# Altium schematic sheet 原理图.SchDoc
size A3
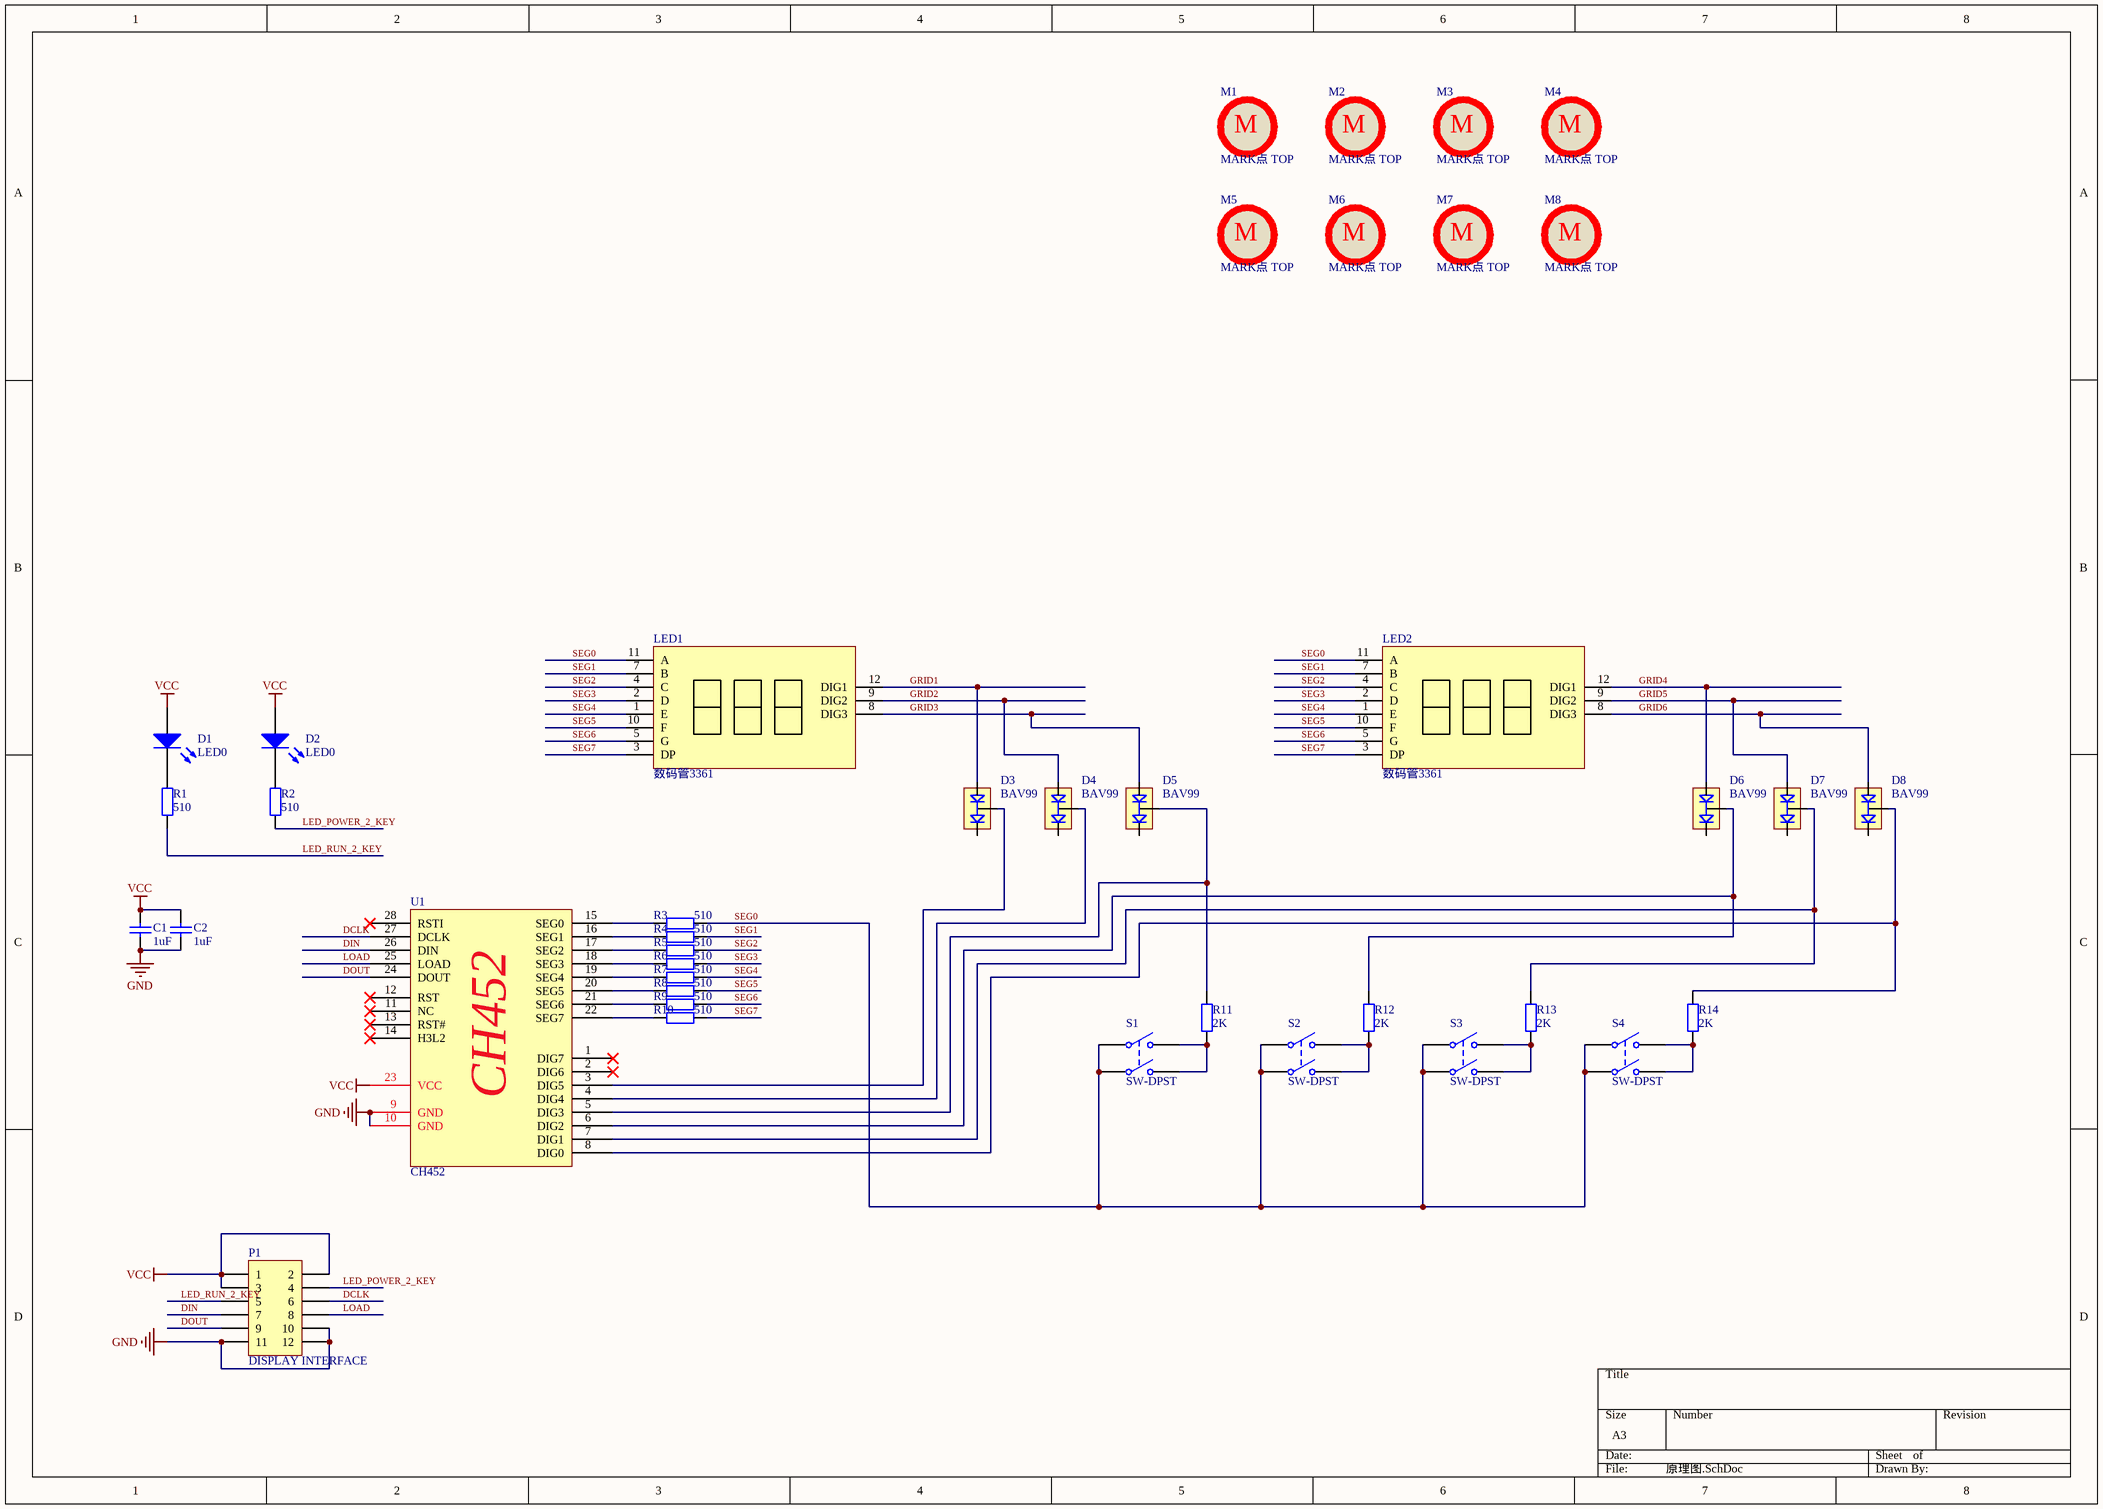
[diagram p0: 原理图.SchDoc]

## Parts
C1  1uF  [C SMD 0603]
C2  1uF  [C SMD 0603]
D1  LED0  [LED DIP 3mm]
D2  LED0  [LED DIP 3mm]
D3  BAV99  [SOT23]
D4  BAV99  [SOT23]
D5  BAV99  [SOT23]
D6  BAV99  [SOT23]
D7  BAV99  [SOT23]
D8  BAV99  [SOT23]
LED1  数码管3361  [数码管3361]
LED2  数码管3361  [数码管3361]
M1  MARK点 TOP  [MARK点 TOP]
M2  MARK点 TOP  [MARK点 TOP]
M3  MARK点 TOP  [MARK点 TOP]
M4  MARK点 TOP  [MARK点 TOP]
M5  MARK点 TOP  [MARK点 TOP]
M6  MARK点 TOP  [MARK点 TOP]
M7  MARK点 TOP  [MARK点 TOP]
M8  MARK点 TOP  [MARK点 TOP]
P1  DISPLAY INTERFACE  [FFC_1.0mm_12pin_弯]
R1  510  [R SMD 0603]
R2  510  [R SMD 0603]
R3  510  [R SMD 0603]
R4  510  [R SMD 0603]
R5  510  [R SMD 0603]
R6  510  [R SMD 0603]
R7  510  [R SMD 0603]
R8  510  [R SMD 0603]
R9  510  [R SMD 0603]
R10  510  [R SMD 0603]
R11  2K  [R SMD 0603]
R12  2K  [R SMD 0603]
R13  2K  [R SMD 0603]
R14  2K  [R SMD 0603]
S1  SW-DPST  [按键 标准型 6*6mm]
S2  SW-DPST  [按键 标准型 6*6mm]
S3  SW-DPST  [按键 标准型 6*6mm]
S4  SW-DPST  [按键 标准型 6*6mm]
U1  CH452  [SO28_N]

## Nets
GND: C1.2 C2.2 P1.10 P1.11 P1.12 U1.9(GND) U1.10(GND)
VCC: C1.1 C2.1 D1.1(A) D2.1(A) P1.1 P1.2 P1.3 U1.23(VCC)
DCLK: P1.6 U1.27(DCLK)
DIN: P1.7 U1.26(DIN)
DOUT: P1.9 U1.24(DOUT)
GRID1: D3.1 LED1.12(DIG1)
GRID2: D4.1 LED1.9(DIG2)
GRID3: D5.1 LED1.8(DIG3)
GRID4: D6.1 LED2.12(DIG1)
GRID5: D7.1 LED2.9(DIG2)
GRID6: D8.1 LED2.8(DIG3)
LED_POWER_2_KEY: P1.4 R2.2
LED_RUN_2_KEY: P1.5 R1.2
LOAD: P1.8 U1.25(LOAD)
SEG0: LED1.11(A) LED2.11(A) R3.1 S1.1(COMMON1) S1.3(COMMON2) S2.1(COMMON1) S2.3(COMMON2) S3.1(COMMON1) S3.3(COMMON2) S4.1(COMMON1) S4.3(COMMON2)
SEG1: LED1.7(B) LED2.7(B) R4.1
SEG2: LED1.4(C) LED2.4(C) R5.1
SEG3: LED1.2(D) LED2.2(D) R6.1
SEG4: LED1.1(E) LED2.1(E) R7.1
SEG5: LED1.10(F) LED2.10(F) R8.1
SEG6: LED1.5(G) LED2.5(G) R9.1
SEG7: LED1.3(DP) LED2.3(DP) R10.1
NetD1_2: D1.2(K) R1.1
NetD2_2: D2.2(K) R2.1
NetD3_3: D3.3 U1.3(DIG5)
NetD4_3: D4.3 U1.4(DIG4)
NetD5_3: D5.3 R11.1 U1.5(DIG3)
NetD6_3: D6.3 R12.1 U1.6(DIG2)
NetD7_3: D7.3 R13.1 U1.7(DIG1)
NetD8_3: D8.3 R14.1 U1.8(DIG0)
NetR3_2: R3.2 U1.15(SEG0)
NetR4_2: R4.2 U1.16(SEG1)
NetR5_2: R5.2 U1.17(SEG2)
NetR6_2: R6.2 U1.18(SEG3)
NetR7_2: R7.2 U1.19(SEG4)
NetR8_2: R8.2 U1.20(SEG5)
NetR9_2: R9.2 U1.21(SEG6)
NetR10_2: R10.2 U1.22(SEG7)
NetR11_2: R11.2 S1.2(NO1) S1.4(NO2)
NetR12_2: R12.2 S2.2(NO1) S2.4(NO2)
NetR13_2: R13.2 S3.2(NO1) S3.4(NO2)
NetR14_2: R14.2 S4.2(NO1) S4.4(NO2)

Not connected (* = marked no-connect by the designer): D3 2; D4 2; D5 2; D6 2; D7 2; D8 2; M1 1; M2 1; M3 1; M4 1; M5 1; M6 1; M7 1; M8 1; U1 1(DIG7)* 2(DIG6)* 11(NC)* 12(RST)* 13(RST#)* 14(H3L2)* 28(RSTI)*

## Notes on the sheet
- (in symbol MARK点 TO) M

## Library data of the parts
C1 C2 = Cap: Capacitor; Value: 0.01uF; Published: 8-Jun-2000; LatestRevisionDate: 17-Jul-2002; LatestRevisionNote: Re-released for DXP Platform.; PackageReference: RAD-0.3; Publisher: Altium Limited
D1 D2 = LED0: Typical INFRARED GaAs LED; Published: 8-Jun-2000; LatestRevisionDate: 08-Jul-2005; LatestRevisionNote: Mech Layer 1 removed.; PackageReference: LED-0; Publisher: Altium Limited
LED1 LED2 = 数码
M1-M8 = MARK点 TO
P1 = Header 6X2: Header, 6-Pin, Dual row; LatestRevisionDate: 17-Jul-2002; LatestRevisionNote: Re-released for DXP Platform.; Publisher: Altium Limited
R1-R14 = Res2: Resistor; Value: 1K; Published: 8-Jun-2000; LatestRevisionDate: 17-Jul-2002; LatestRevisionNote: Re-released for DXP Platform.; PackageReference: AXIAL-0.4; Publisher: Altium Limited
S1-S4 = SW-DPST: Double-Pole, Single-Throw Switch; Published: 24-Mar-1999; LatestRevisionDate: 17-Jul-2002; LatestRevisionNote: Re-released for DXP Platform.; PackageReference: DPST-4; Publisher: Altium Limited